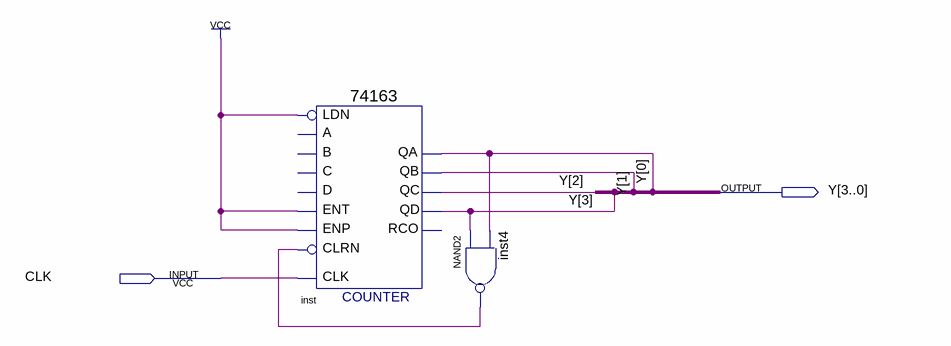
[diagram p0: schematic sheet]
// Quartus schematic SpecialCount0_9.bdf as structural Verilog: 2 symbols, 2 pins
module SpecialCount0_9 (
  input  CLK,
  output [3:0] Y
);

  wire inst4_out;

  \74163  inst (
    .ENT(1'b1), .CLRN(inst4_out), .CLK(CLK), .ENP(1'b1), .LDN(1'b1), .QA(Y[0]), .QB(Y[1]), .QC(Y[2]),
    .QD(Y[3]));  // open: C, B, A, D, RCO
  nand inst4 (inst4_out, Y[3], Y[0]);
endmodule
